# EAGLE design 0226-FETz-0126-carrier (EAGLE 9.6.2)
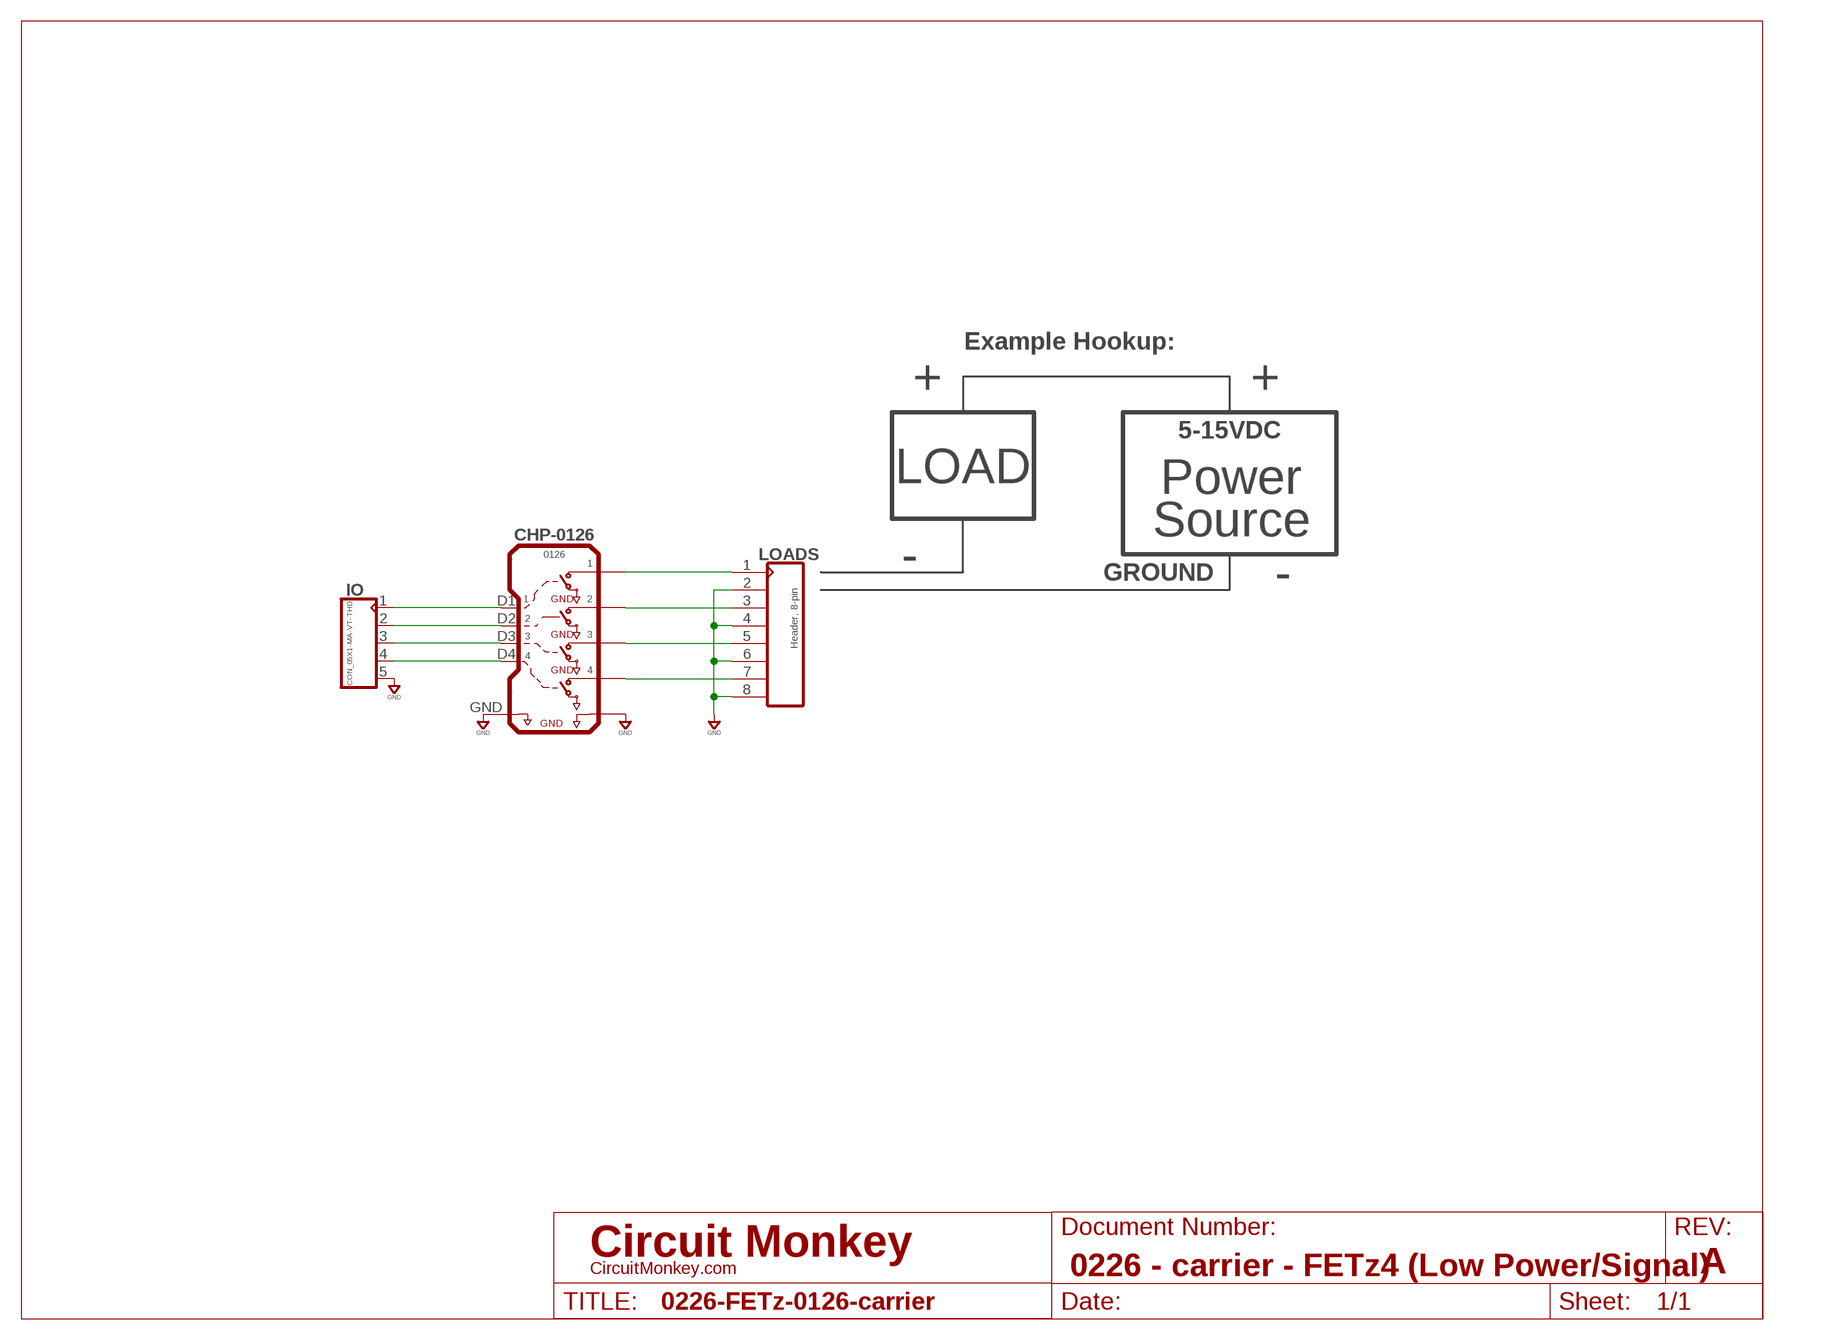
[diagram p0: schematic, sheet 1]
SHEET1 (LETTER_L-CIRCUITMONKEY): DOCUMENT_NUMBER: 0226 - carrier - FETz4 (Low Power/Signal); REV: A

## Parts
CHP-0126  0126  0126REV-A  [0126A]
IO  CON_05X1-MA-VT-THD  [MA05X1-VT-THD]
LOADS  Header, 8-pin  CON_08X1-VT-THD  [MA08X1-VT-THD]

## Nets
GND: CHP-0126.GND CHP-0126.GNDL(GND2) IO.5 LOADS.2 LOADS.4 LOADS.6 LOADS.8
N$1: CHP-0126.D1 IO.1
N$2: CHP-0126.D2 IO.2
N$3: CHP-0126.D3 IO.3
N$4: CHP-0126.D4 IO.4
N$5: CHP-0126.L1 LOADS.1
N$6: CHP-0126.L2 LOADS.3
N$7: CHP-0126.L3 LOADS.5
N$8: CHP-0126.L4 LOADS.7

## Notes on the sheet
- Example Hookup:
- + | +
- 5-15VDC
- LOAD
- Power
  Source
- -
- GROUND | -

## Library data of the parts
CHP-0126 = circuit-monkey-chips:0126: Four FETs - Lower Power; COST01: 5.00; COST10: 4.00; COST100: 2.00; MFR: Circuit Monkey; MPN: 0126A
IO = con-headers:CON_05X1: Connector, 5P
LOADS = con-headers:CON_08X1: Header, 8-pin, 1-row, 2.54mm; COST01: 0.14

## Board
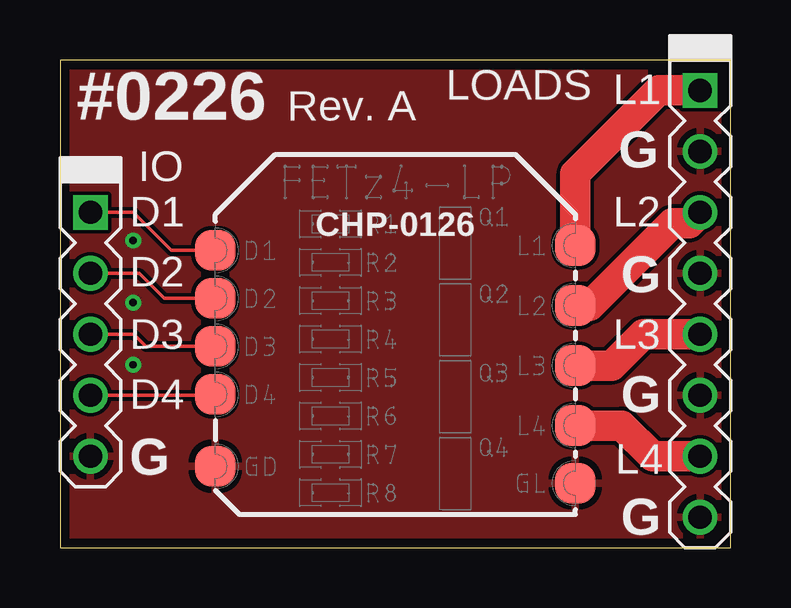
[diagram p1: board, top side]
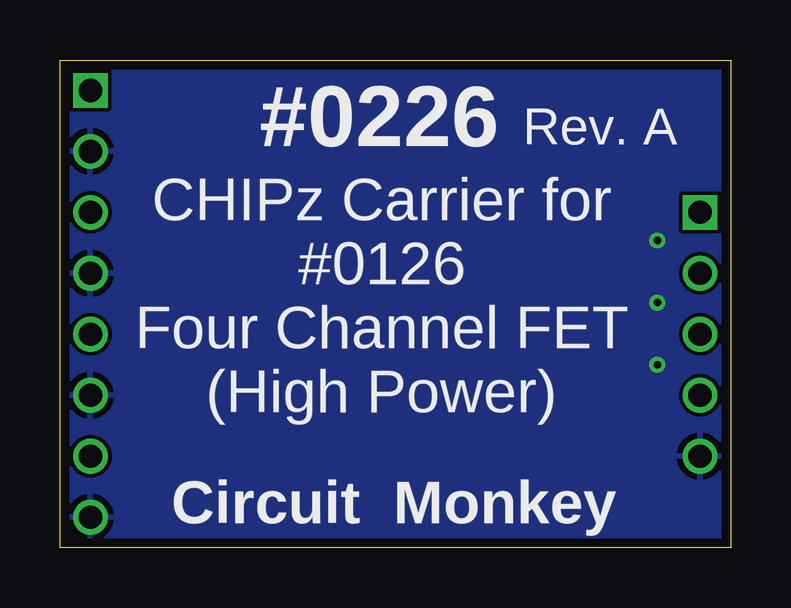
[diagram p2: board, bottom side, seen from below]

Size 27.94 x 20.32 mm. Coordinates in mm from the lower left corner, seen from the top.
Outline: 0,0 27.94,0 27.94,20.32 0,20.32 0,0
Copper layers (1*16): Top 0.0356mm / dielectric 1.5011mm / Bottom 0.0356mm
Design rules "OSH-CircuitMonkey *": minimum track width 6mil, minimum drill 12mil, track to track 6mil, track to pad 6mil, pad to pad 6mil, via to via 6mil, smd to smd 6mil, copper to edge 15mil, drill to drill 6mil, minimum pad ring 7mil, minimum via ring 7mil, stop-mask expansion 3mil, vias tented up to drill 13mil, thermal gap 10mil

### Footprints (pad centres in the part's own frame; a part is rotated, then mirrored left to right if it is on the bottom)
0126A = smd 1.7 x 1.7: D1 -7.5,3.5; D2 -7.5,1.5; D3 -7.5,-0.5; D4 -7.5,-2.5; GND -7.5,-5.5; GNDL 7.5,-6.2; L1 7.5,3.7; L2 7.5,1.2; L3 7.5,-1.3; L4 7.5,-3.8
MA05X1-VT-THD = drill 0.965 square: 1 0,0 | drill 0.965: 2 2.54,0; 3 5.08,0; 4 7.62,0; 5 10.16,0
MA08X1-VT-THD = drill 0.965 square: 1 -8.89,0 | drill 0.965: 2 -6.35,0; 3 -3.81,0; 4 -1.27,0; 5 1.27,0; 6 3.81,0; 7 6.35,0; 8 8.89,0

### Placement (x,y rotation side)
CHP-0126  13.97,8.89 0 top
IO  1.27,13.97 270 top
LOADS  26.67,10.16 270 top

### Tracks (layer width: path | path; a pad name or v marks a point on that pad's centre or on a via)
GND  (via drill 0.3)
  other vias: 3.05,12.8 3.05,10.21 3.05,7.62
  pour Bottom: 0,0 0,20.32 27.94,20.32 27.94,0
  pour Top: 0,0 27.94,0 27.94,20.32 0,20.32
N$1
  Top 0.152: IO.1 3.06,13.97 4.64,12.39 CHP-0126.D1
N$2
  Top 0.152: IO.2 3.3,11.43 4.34,10.39 CHP-0126.D2
N$3
  Top 0.152: IO.3 3.07,8.89 3.57,8.39 CHP-0126.D3
N$4
  Top 0.152: IO.4 6.43,6.35 CHP-0126.D4
N$5
  Top 1.27: CHP-0126.L1 21.47,15.58 24.94,19.05 LOADS.1
N$6
  Top 1.27: CHP-0126.L2 22.08,10.09 25.5,13.51 26.21,13.51 LOADS.3
N$7
  Top 1.27: CHP-0126.L3 22.99,7.59 24.29,8.89 LOADS.5
N$8
  Top 1.27: CHP-0126.L4 23.41,5.09 24.69,3.81 LOADS.7

### Text on the board
tPlace: #0226 | L1 | Rev. A | G | D1 | L2 | D2 | G | D3 | L3 | D4 | G | G | L4 | G
bPlace: Rev. A | #0226 | CHIPz Carrier for / #0126 / Four Channel FET / (High Power) | Circuit Monkey